# EAGLE design spindle_light (EAGLE 9.5.1)
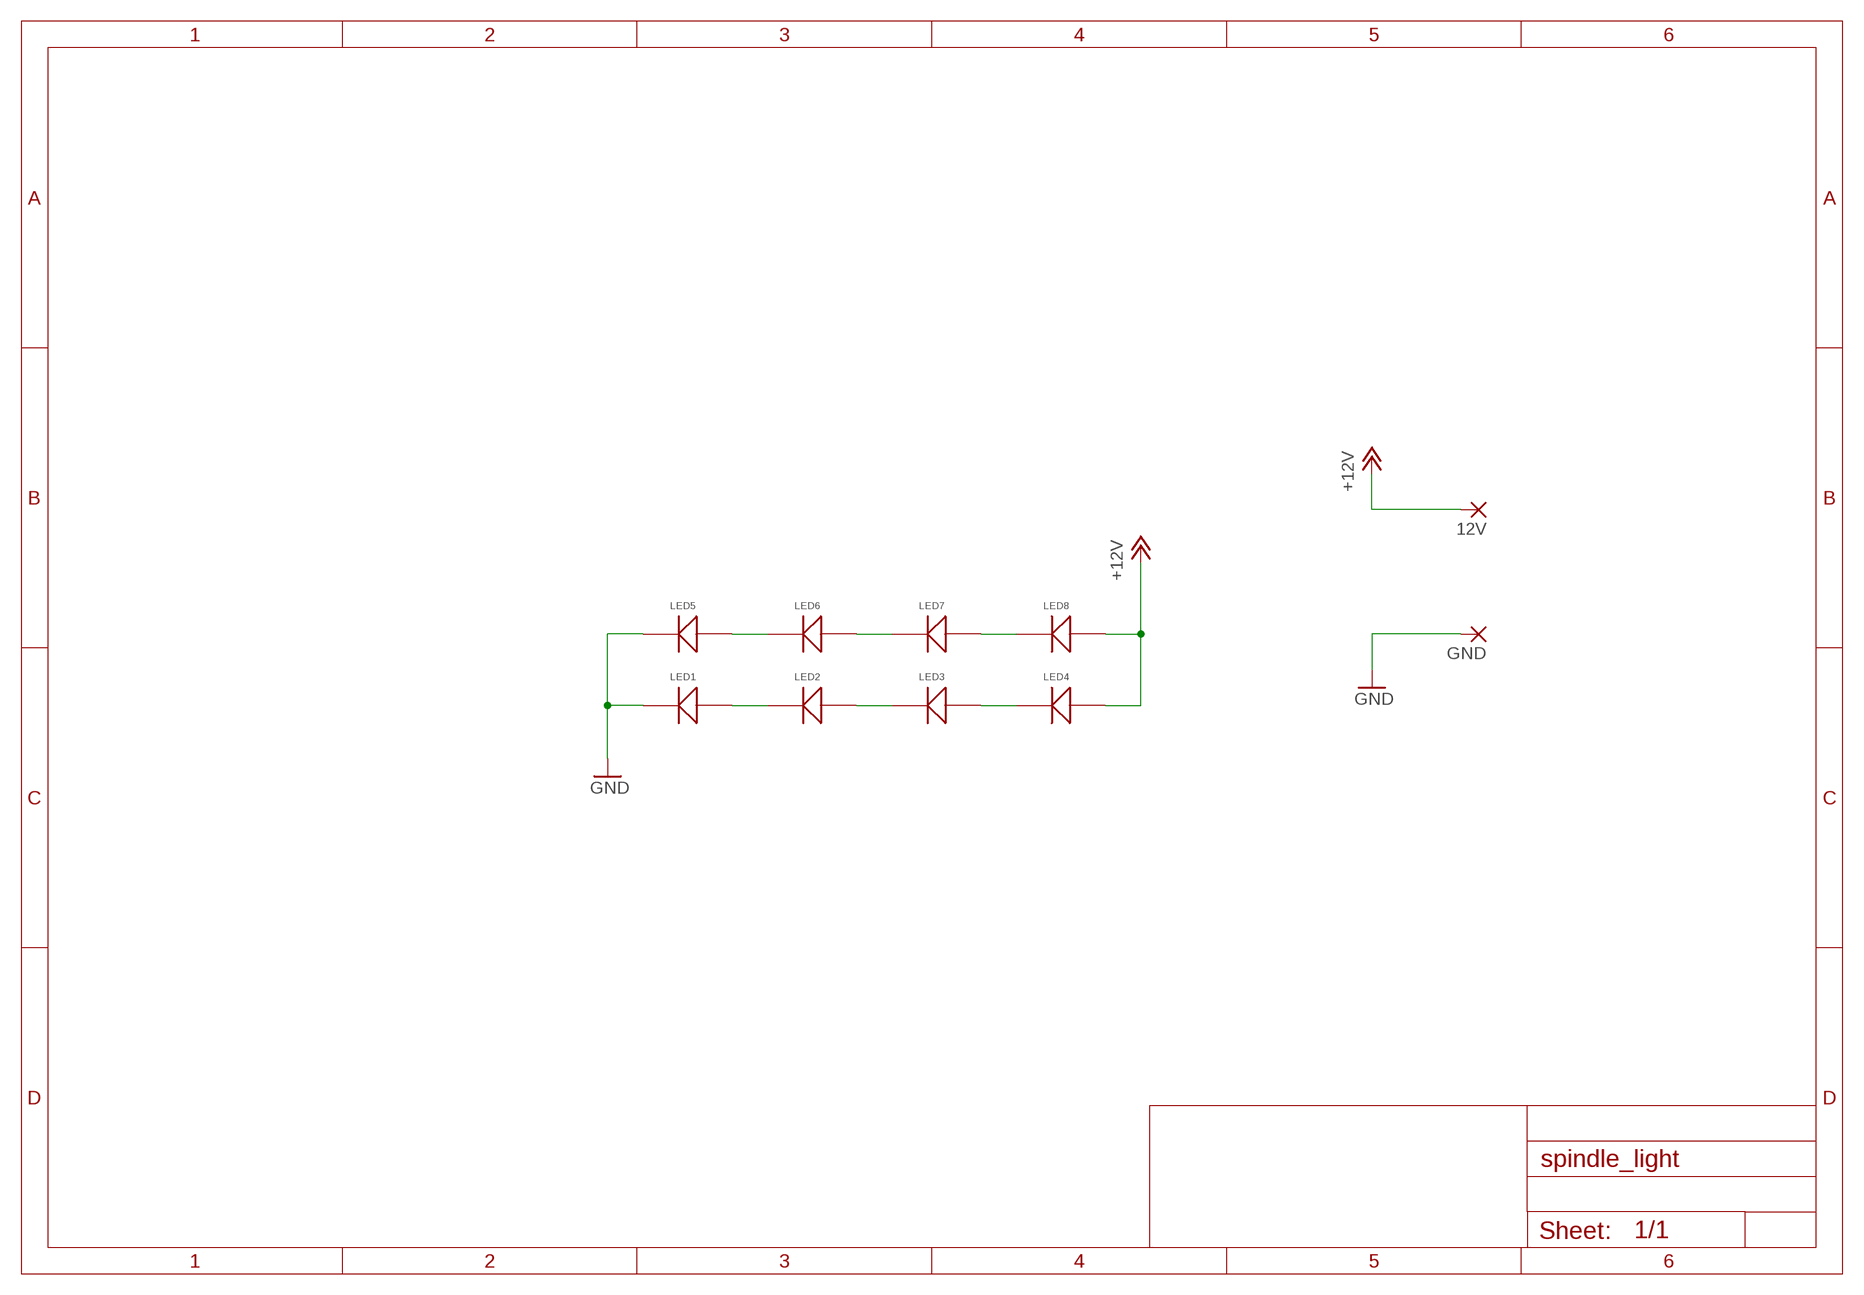
[diagram p0: schematic, sheet 1]

## Parts
12V  SMD5  [SMD2,54-5,08]
GND  SMD5  [SMD2,54-5,08]
LED1  RF-45HA50DS-EE-Y  [5050LED]
LED2  RF-45HA50DS-EE-Y  [5050LED]
LED3  RF-45HA50DS-EE-Y  [5050LED]
LED4  RF-45HA50DS-EE-Y  [5050LED]
LED5  RF-45HA50DS-EE-Y  [5050LED]
LED6  RF-45HA50DS-EE-Y  [5050LED]
LED7  RF-45HA50DS-EE-Y  [5050LED]
LED8  RF-45HA50DS-EE-Y  [5050LED]

## Nets
+12V: 12V.1(P) LED4.P$4 LED4.P$5 LED4.P$6 LED8.P$4 LED8.P$5 LED8.P$6
GND: GND.1(P) LED1.P$1 LED1.P$2 LED1.P$3 LED5.P$1 LED5.P$2 LED5.P$3
N$2: LED5.P$4 LED5.P$5 LED5.P$6 LED6.P$1 LED6.P$2 LED6.P$3
N$3: LED1.P$4 LED1.P$5 LED1.P$6 LED2.P$1 LED2.P$2 LED2.P$3
N$4: LED2.P$4 LED2.P$5 LED2.P$6 LED3.P$1 LED3.P$2 LED3.P$3
N$5: LED6.P$4 LED6.P$5 LED6.P$6 LED7.P$1 LED7.P$2 LED7.P$3
N$8: LED7.P$4 LED7.P$5 LED7.P$6 LED8.P$1 LED8.P$2 LED8.P$3
N$9: LED3.P$4 LED3.P$5 LED3.P$6 LED4.P$1 LED4.P$2 LED4.P$3

## Library data of the parts
12V GND = wirepad:SMD5: SMD PAD
LED1-LED8 = NikodemBartnik:RF-45HA50DS-EE-Y: LED; SMD; 5050,PLCC6; biały neutralny; 5300÷10000mcd; 4450-5000K

## Board
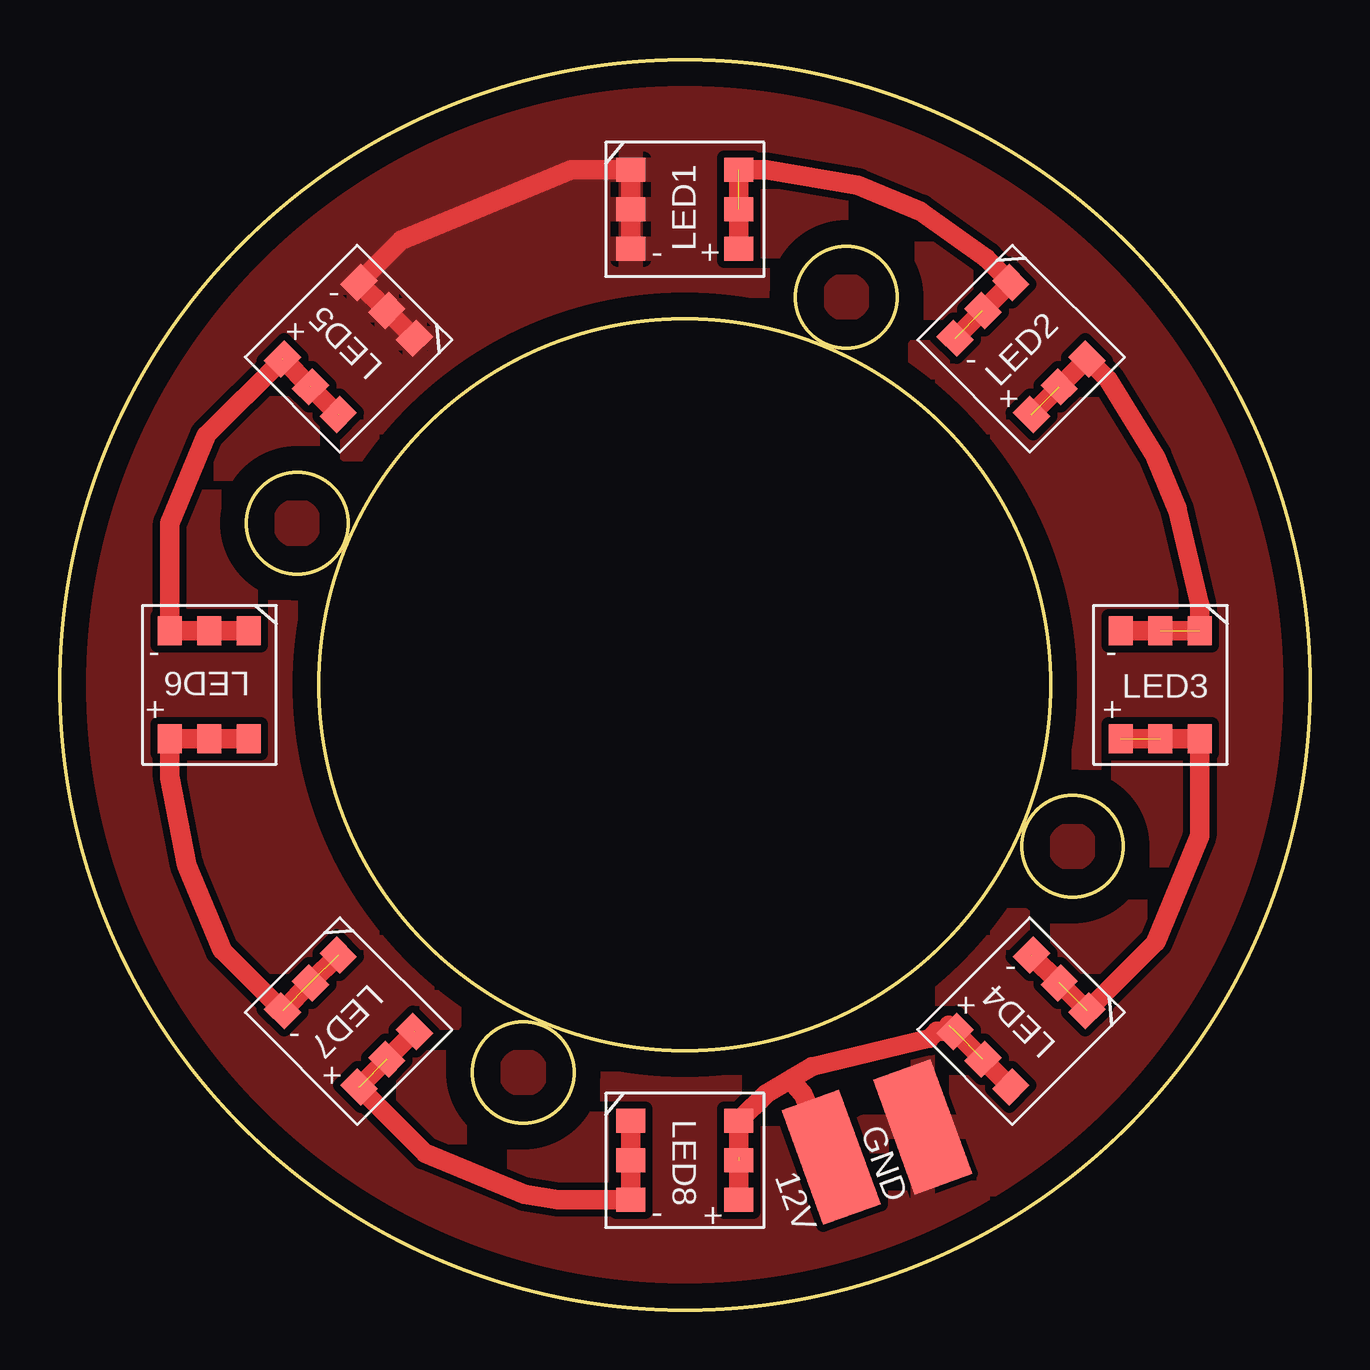
[diagram p1: board, top side]

Size 52.07 x 52.07 mm. Coordinates in mm from the lower left corner, seen from the top.
Outline: circle at 26.04,26.04 radius 26.04
Outline: circle at 32.77,42.19 radius 2.11
Outline: circle at 42.19,19.3 radius 2.11
Outline: circle at 19.3,9.88 radius 2.11
Outline: circle at 9.88,32.77 radius 2.11
Outline: circle at 26.04,26.04 radius 15.24
Copper layers (1*16): Top 0.035mm / dielectric 1.5mm / Bottom 0.035mm
Design rules "default": minimum track width 6mil, minimum drill 0.35mm, track to track 6mil, track to pad 6mil, pad to pad 6mil, via to via 6mil, smd to smd 6mil, copper to edge 40mil, drill to drill 6mil, minimum pad ring 10mil, minimum via ring 8mil, stop-mask expansion 4mil, vias tented up to drill 0mil, thermal gap 10mil

### Footprints (pad centres in the part's own frame; a part is rotated, then mirrored left to right if it is on the bottom)
SMD2,54-5,08 = smd 2.54 x 5.08: 1 0,0
5050LED = smd 1.2 x 1: P$1 -2.25,1.64; P$2 -2.25,0; P$3 -2.25,-1.64; P$4 2.25,1.64; P$5 2.25,0; P$6 2.25,-1.64

### Placement (x,y rotation side)
12V  32.13,6.35 20 top
GND  35.94,7.62 20 top
LED1  26.04,45.85 0 top
LED2  40.04,40.04 315 top
LED3  45.85,26.04 270 top
LED4  40.04,12.03 225 top
LED5  12.03,40.04 225 top
LED6  6.22,26.04 270 top
LED7  12.03,12.03 315 top
LED8  26.04,6.22 0 top

### Tracks (layer width: path | path; a pad name or v marks a point on that pad's centre or on a via)
+12V  (3 unrouted)
  Top 0.813: LED4.P$5 | LED4.P$5 37.04,11.85 | LED4.P$5 LED4.P$4 | LED4.P$4 | LED8.P$4 28.29,6.35 | LED8.P$6 LED8.P$5 28.41,6.35 | 31.69,6.79 12V.1 30.95,9 30.69,9.26 30.63,9.38 | LED8.P$4 28.87,8.45 | LED4.P$6 36.53,11.59 36.24,11.3 31.32,10.12 30.51,9.65 30.63,9.38 | LED8.P$4 29.42,9 30.52,9.64 30.63,9.38
  cutout Top (isolate 0.305): 11.49,25.97 arc-90 26.16,40.64 arc-90 40.64,26.16 arc-90 25.97,11.49 arc-90
GND
  Top 0.61: LED5.P$2 | LED5.P$1
  Top 0.813: LED1.P$3 LED1.P$2 LED1.P$1 21.3,47.49 14.21,44.55 LED5.P$3 LED5.P$2 LED5.P$1
  pour Top (isolate 0.305): -0.7,25.97 arc90 26.23,-0.95 arc90 53.21,26.04 arc90 26.29,52.96 arc90
N$2  (4 unrouted)
  Top 0.813: LED5.P$6 6.1,36.43 4.58,32.77 LED6.P$3 LED6.P$2 LED6.P$1 | LED5.P$6 LED5.P$5 | LED5.P$5 | LED5.P$4 LED5.P$5
N$3  (2 unrouted)
  Top 0.813: LED1.P$6 LED1.P$4 29.43,47.49 33.25,46.85 35.85,45.78 38.59,43.81 LED2.P$1 LED2.P$3
N$4  (2 unrouted)
  Top 0.813: LED2.P$6 LED2.P$4 43.67,38.74 45.64,35.56 46.55,33.35 47.49,29.37 LED3.P$1 LED3.P$3
N$5  (3 unrouted)
  Top 0.813: LED7.P$2 LED7.P$3 6.75,14.98 5.29,18.52 4.58,22.18 LED6.P$6 LED6.P$5 LED6.P$4 | LED7.P$2 | LED7.P$2 LED7.P$1 | LED7.P$1
N$8  (4 unrouted)
  Top 0.813: LED7.P$6 15.21,6.53 19.35,4.81 20.73,4.58 LED8.P$3 LED8.P$2 LED8.P$1 | LED7.P$6 LED7.P$5 | LED7.P$5 | LED7.P$5 LED7.P$4 | LED7.P$4
N$9  (3 unrouted)
  Top 0.813: LED3.P$6 LED3.P$4 47.49,19.75 45.65,15.31 LED4.P$1 | LED4.P$3 LED4.P$2 | LED4.P$2 | LED4.P$2 LED4.P$1 | LED4.P$1

### Text on the board
tNames: - | + | - | + | - | + | - | - | + | + | - | + | - | + | - | +
bNames: NIKODEM BARTNIK | INDYSTRY.CC | 26.11.2021 | SPINDLE LIGHT